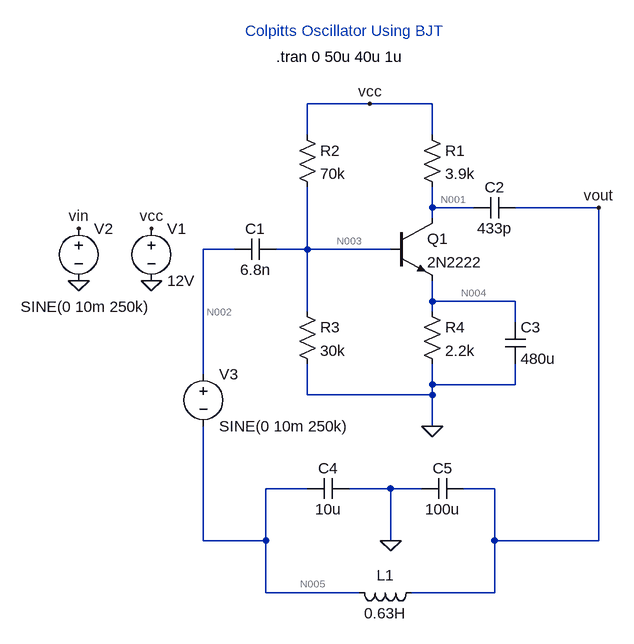
[diagram p0: schematic colpitts_oscillator_using_BJT.asc]
colpitts_oscillator_using_BJT.asc, the LTspice schematic file:
Version 4.1
SHEET 1 880 768
WIRE 336 -32 240 -32
WIRE 432 -32 336 -32
WIRE 240 16 240 -32
WIRE 432 16 432 -32
WIRE 432 128 432 96
WIRE 496 128 432 128
WIRE 688 128 560 128
WIRE 432 144 432 128
WIRE 128 192 80 192
WIRE 240 192 240 96
WIRE 240 192 192 192
WIRE 368 192 240 192
WIRE 432 272 432 240
WIRE 560 272 432 272
WIRE 240 288 240 192
WIRE 432 288 432 272
WIRE 560 304 560 272
WIRE 80 384 80 192
WIRE 432 400 432 368
WIRE 560 400 560 368
WIRE 560 400 432 400
WIRE 240 416 240 368
WIRE 432 416 432 400
WIRE 432 416 240 416
WIRE 432 464 432 416
WIRE 240 560 176 560
WIRE 368 560 304 560
WIRE 416 560 368 560
WIRE 528 560 480 560
WIRE 80 640 80 464
WIRE 176 640 176 560
WIRE 176 640 80 640
WIRE 368 640 368 560
WIRE 528 640 528 560
WIRE 688 640 688 128
WIRE 688 640 528 640
WIRE 176 720 176 640
WIRE 320 720 176 720
WIRE 528 720 528 640
WIRE 528 720 400 720
FLAG 0 240 0
FLAG 0 160 vcc
FLAG 336 -32 vcc
FLAG 688 128 vout
FLAG -112 160 vin
FLAG -112 240 0
FLAG 432 464 0
FLAG 368 640 0
SYMBOL voltage 0 144 R0
WINDOW 123 0 0 Left 0
WINDOW 39 0 0 Left 0
SYMATTR InstName V1
SYMATTR Value 12V
SYMBOL npn 368 144 R0
SYMATTR InstName Q1
SYMATTR Value 2N2222
SYMBOL res 416 0 R0
SYMATTR InstName R1
SYMATTR Value 3.9k
SYMBOL res 224 0 R0
SYMATTR InstName R2
SYMATTR Value 70k
SYMBOL res 224 272 R0
SYMATTR InstName R3
SYMATTR Value 30k
SYMBOL res 416 272 R0
SYMATTR InstName R4
SYMATTR Value 2.2k
SYMBOL cap 192 176 R90
WINDOW 0 0 32 VBottom 2
WINDOW 3 32 32 VTop 2
SYMATTR InstName C1
SYMATTR Value 6.8n
SYMBOL cap 560 112 R90
WINDOW 0 0 32 VBottom 2
WINDOW 3 32 32 VTop 2
SYMATTR InstName C2
SYMATTR Value 433p
SYMBOL voltage -112 144 R0
WINDOW 3 -89 136 Left 2
WINDOW 123 0 0 Left 0
WINDOW 39 0 0 Left 0
SYMATTR Value SINE(0 10m 250k)
SYMATTR InstName V2
SYMBOL cap 544 304 R0
SYMATTR InstName C3
SYMATTR Value 480u
SYMBOL cap 304 544 R90
WINDOW 0 0 32 VBottom 2
WINDOW 3 32 32 VTop 2
SYMATTR InstName C4
SYMATTR Value 10u
SYMBOL cap 480 544 R90
WINDOW 0 0 32 VBottom 2
WINDOW 3 32 32 VTop 2
SYMATTR InstName C5
SYMATTR Value 100u
SYMBOL ind 416 704 R90
WINDOW 0 5 56 VBottom 2
WINDOW 3 32 56 VTop 2
SYMATTR InstName L1
SYMATTR Value 0.63H
SYMBOL voltage 80 368 R0
WINDOW 123 0 0 Left 0
WINDOW 39 0 0 Left 0
SYMATTR InstName V3
SYMATTR Value SINE(0 10m 250k)
TEXT 192 -104 Left 2 !.tran 0 50u 40u 1u
TEXT 144 -144 Left 2 ;Colpitts Oscillator Using BJT

The netlist it stands for:
* colpitts_oscillator_using_BJT.asc
V1 vcc 0 12V
Q1 N001 N003 N004 0 2N2222
R1 vcc N001 3.9k
R2 vcc N003 70k
R3 N003 0 30k
R4 N004 0 2.2k
C1 N003 N002 6.8n
C2 vout N001 433p
V2 vin 0 SINE(0 10m 250k)
C3 N004 0 480u
C4 0 N005 10u
C5 vout 0 100u
L1 vout N005 0.63H
V3 N002 N005 SINE(0 10m 250k)
.model NPN NPN
.model PNP PNP
.lib standard.bjt
.tran 0 50u 40u 1u
* Colpitts Oscillator Using BJT
.backanno
.end

* Results of the author's LTspice run, read from the files saved beside the schematic
* Operating Point, zero values left out:
*   V(n001) = 7.043 V
*   V(n004) = 2.81 V
*   V(n002) = 26.05 nV
*   V(vcc) = 12 V
*   V(n003) = 3.471 V
*   V(vout) = 26.05 nV
*   V(n005) = 26.05 nV
*   I(V1) = -1.393 mA
*   I(R3) = 115.7 µA
*   I(R4) = 1.277 mA
*   I(R1) = 1.271 mA
*   Ic(Q1) = 1.271 mA
*   Ib(Q1) = 6.161 µA
*   Ie(Q1) = -1.277 mA
*   I(R2) = 121.8 µA